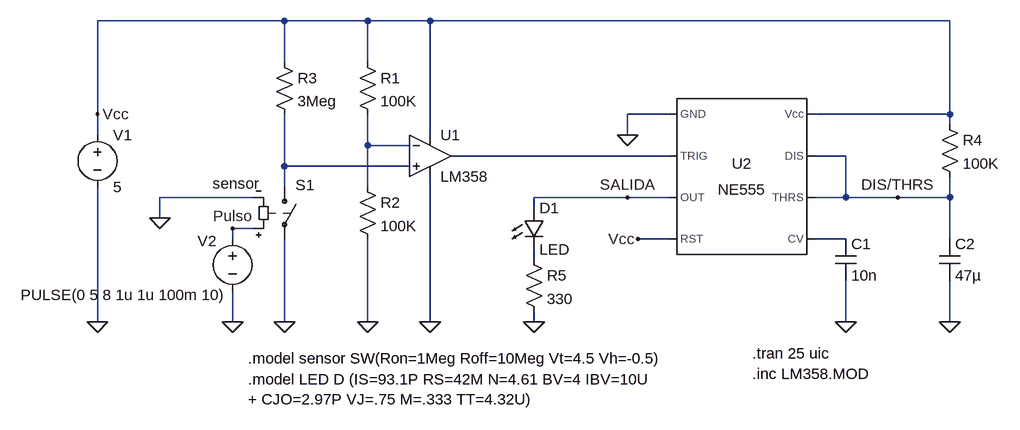
[diagram p0: schematic encendido-temporizado-led.asc]
encendido-temporizado-led.asc, the LTspice schematic file:
Version 4
SHEET 1 1184 680
WIRE 80 -48 -208 -48
WIRE 208 -48 80 -48
WIRE 304 -48 208 -48
WIRE 1104 -48 304 -48
WIRE 80 16 80 -48
WIRE 208 16 208 -48
WIRE -208 96 -208 -48
WIRE 672 96 608 96
WIRE 1104 96 1104 -48
WIRE 1104 96 896 96
WIRE 1104 112 1104 96
WIRE -208 128 -208 96
WIRE 304 128 304 -48
WIRE 608 128 608 96
WIRE 208 144 208 96
WIRE 272 144 208 144
WIRE 672 160 336 160
WIRE 944 160 896 160
WIRE 80 176 80 96
WIRE 272 176 80 176
WIRE 80 208 80 176
WIRE 208 208 208 144
WIRE 32 224 -112 224
WIRE 608 224 464 224
WIRE 672 224 608 224
WIRE 944 224 944 160
WIRE 944 224 896 224
WIRE 1024 224 944 224
WIRE 1104 224 1104 192
WIRE 1104 224 1024 224
WIRE 464 240 464 224
WIRE -112 256 -112 224
WIRE 32 272 0 272
WIRE 0 288 0 272
WIRE 672 288 624 288
WIRE 944 288 896 288
WIRE 1104 288 1104 224
WIRE 464 320 464 304
WIRE -208 416 -208 208
WIRE 0 416 0 368
WIRE 80 416 80 288
WIRE 208 416 208 288
WIRE 304 416 304 192
WIRE 464 416 464 400
WIRE 944 416 944 352
WIRE 1104 416 1104 352
FLAG 80 416 0
FLAG 208 416 0
FLAG 304 416 0
FLAG -208 416 0
FLAG 944 416 0
FLAG 624 288 Vcc
FLAG 608 224 SALIDA
FLAG 608 128 0
FLAG 1104 416 0
FLAG 1024 224 DIS/THRS
FLAG -208 96 Vcc
FLAG 464 416 0
FLAG -112 256 0
FLAG 0 416 0
FLAG 0 272 Pulso
SYMBOL Opamps\\opamp2 304 96 R0
SYMATTR InstName U1
SYMATTR Value LM358
SYMBOL voltage -208 112 R0
WINDOW 123 0 0 Left 0
WINDOW 39 0 0 Left 0
SYMATTR InstName V1
SYMATTR Value 5
SYMBOL res 192 0 R0
SYMATTR InstName R1
SYMATTR Value 100K
SYMBOL res 192 192 R0
SYMATTR InstName R2
SYMATTR Value 100K
SYMBOL res 64 0 R0
SYMATTR InstName R3
SYMATTR Value 3Meg
SYMBOL Misc\\NE555 784 192 R0
SYMATTR InstName U2
SYMBOL res 1088 96 R0
SYMATTR InstName R4
SYMATTR Value 100K
SYMBOL cap 928 288 R0
SYMATTR InstName C1
SYMATTR Value 10n
SYMBOL cap 1088 288 R0
SYMATTR InstName C2
SYMATTR Value 47µ
SYMBOL res 448 304 R0
SYMATTR InstName R5
SYMATTR Value 330
SYMBOL LED 448 240 R0
SYMATTR InstName D1
SYMATTR Value LED
SYMBOL sw 80 192 R0
WINDOW 0 17 13 Left 2
WINDOW 3 -111 11 Left 2
SYMATTR InstName S1
SYMATTR Value sensor
SYMBOL voltage 0 272 R0
WINDOW 0 -54 19 Left 2
WINDOW 3 -326 102 Left 2
WINDOW 123 0 0 Left 0
WINDOW 39 0 0 Left 0
SYMATTR InstName V2
SYMATTR Value PULSE(0 5 8 1u 1u 100m 10)
TEXT 800 464 Left 2 !.tran 25 uic
TEXT 24 504 Left 2 !.model LED D (IS=93.1P RS=42M N=4.61 BV=4 IBV=10U\n+ CJO=2.97P VJ=.75 M=.333 TT=4.32U)
TEXT 24 472 Left 2 !.model sensor SW(Ron=1Meg Roff=10Meg Vt=4.5 Vh=-0.5)
TEXT 800 496 Left 2 !.inc LM358.MOD

The netlist it stands for:
* encendido-temporizado-led.asc
XU1 N003 N001 Vcc 0 N002 LM358  ; pins In+ In- V+ V- OUT
V1 Vcc 0 5
R1 Vcc N001 100K
R2 N001 0 100K
R3 Vcc N003 3Meg
XU2 0 N002 SALIDA Vcc N004 DIS/THRS DIS/THRS Vcc NE555  ; pins GND TRIG OUT RST CV THRS DIS Vcc
R4 Vcc DIS/THRS 100K
C1 N004 0 10n
C2 DIS/THRS 0 47µ
R5 N005 0 330
D1 SALIDA N005 LED
S1 N003 0 Pulso 0 sensor
V2 Pulso 0 PULSE(0 5 8 1u 1u 100m 10)
.model D D
.lib standard.dio
.tran 25 uic
.model LED D (IS=93.1P RS=42M N=4.61 BV=4 IBV=10U
+ CJO=2.97P VJ=.75 M=.333 TT=4.32U)
.model sensor SW(Ron=1Meg Roff=10Meg Vt=4.5 Vh=-0.5)
.inc LM358.MOD
.lib NE555.sub
.backanno
.end